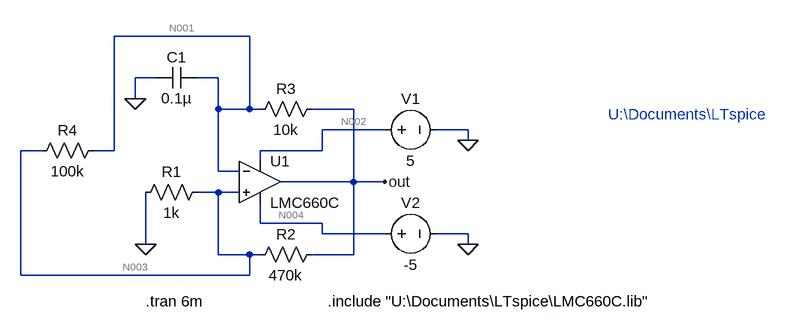
[diagram p0: schematic Square_Wave_Generator.asc]
Square_Wave_Generator.asc, the LTspice schematic file:
Version 4.1
SHEET 1 1384 680
WIRE 256 -112 48 -112
WIRE 112 -48 80 -48
WIRE 208 -48 176 -48
WIRE 80 -16 80 -48
WIRE 208 0 208 -48
WIRE 256 0 256 -112
WIRE 256 0 208 0
WIRE 272 0 256 0
WIRE 416 0 352 0
WIRE 464 32 368 32
WIRE 592 32 544 32
WIRE 592 48 592 32
WIRE -64 64 -96 64
WIRE 48 64 48 -112
WIRE 48 64 16 64
WIRE 368 64 368 32
WIRE 368 64 272 64
WIRE 272 80 272 64
WIRE 208 96 208 0
WIRE 240 96 208 96
WIRE 416 112 416 0
WIRE 416 112 304 112
WIRE 464 112 416 112
WIRE 208 128 176 128
WIRE 240 128 208 128
WIRE 272 176 272 144
WIRE 368 176 272 176
WIRE 368 192 368 176
WIRE 464 192 368 192
WIRE 592 192 544 192
WIRE 96 208 96 128
WIRE 592 208 592 192
WIRE 208 224 208 128
WIRE 256 224 208 224
WIRE 272 224 256 224
WIRE 416 224 416 112
WIRE 416 224 352 224
WIRE -96 256 -96 64
WIRE 256 256 256 224
WIRE 256 256 -96 256
FLAG 96 208 0
FLAG 80 -16 0
FLAG 464 112 out
FLAG 592 48 0
FLAG 592 208 0
SYMBOL res 192 112 R90
WINDOW 0 0 56 VBottom 2
WINDOW 3 32 56 VTop 2
SYMATTR InstName R1
SYMATTR Value 1k
SYMBOL res 368 208 R90
WINDOW 0 0 56 VBottom 2
WINDOW 3 32 56 VTop 2
SYMATTR InstName R2
SYMATTR Value 470k
SYMBOL res 368 -16 R90
WINDOW 0 0 56 VBottom 2
WINDOW 3 32 56 VTop 2
SYMATTR InstName R3
SYMATTR Value 10k
SYMBOL cap 176 -64 R90
WINDOW 0 0 32 VBottom 2
WINDOW 3 32 32 VTop 2
SYMATTR InstName C1
SYMATTR Value 0.1µ
SYMBOL voltage 448 32 R270
WINDOW 0 32 56 VTop 2
WINDOW 3 -32 56 VBottom 2
WINDOW 123 0 0 Left 0
WINDOW 39 0 0 Left 0
SYMATTR InstName V1
SYMATTR Value 5
SYMBOL voltage 448 192 R270
WINDOW 0 32 56 VTop 2
WINDOW 3 -32 56 VBottom 2
WINDOW 123 0 0 Left 0
WINDOW 39 0 0 Left 0
SYMATTR InstName V2
SYMATTR Value -5
SYMBOL OpAmps\\opamp2 272 48 R0
SYMATTR InstName U1
SYMATTR Value LMC660C
SYMBOL res 32 48 R90
WINDOW 0 0 56 VBottom 2
WINDOW 3 32 56 VTop 2
SYMATTR InstName R4
SYMATTR Value 100k
TEXT 96 296 Left 2 !.tran 6m
TEXT 376 296 Left 2 !.include "U:\\Documents\\LTspice\\LMC660C.lib"
TEXT 808 8 Left 2 ;U:\\Documents\\LTspice

The netlist it stands for:
* Square_Wave_Generator.asc
R1 N003 0 1k
R2 out N003 470k
R3 out N001 10k
C1 N001 0 0.1µ
V1 N002 0 5
V2 N004 0 -5
X§U1 N003 N001 N002 N004 out LMC660C  ; pins In+ In- V+ V- OUT
R4 N001 N003 100k
.tran 6m
.include "U:\Documents\LTspice\LMC660C.lib"
* U:\Documents\LTspice
.backanno
.end

* Results of the author's LTspice run, read from the files saved beside the schematic
* Operating Point, zero values left out:
*   V(out) = 6.674 mV
*   V(n002) = 5 V
*   V(n004) = -5 V
*   V(n003) = 74.05 µV
*   V(n001) = 6.074 mV
*   I(R3) = 60 nA
*   I(V1) = -393.9 µA
*   I(R1) = 74.05 nA
*   I(V2) = 393.8 µA
*   I(R2) = 14.04 nA
*   I(R4) = 60 nA
*   Ix(u1:99) = 393.9 µA
*   Ix(u1:50) = -393.8 µA
*   Ix(u1:28) = -74.05 nA
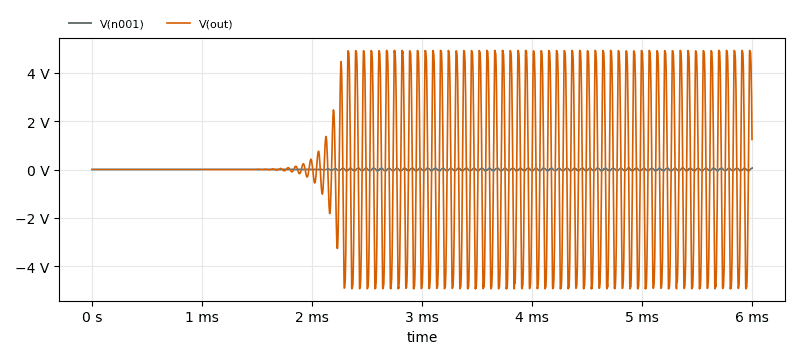
[diagram p1: Transient Analysis of Square_Wave_Generator.asc, plotted from the saved traces]
* Transient Analysis, 1 run:
*   V(n001): min -53.56 mV, max 65.89 mV, average 6.011 mV, rms 33.21 mV, last 63.77 mV
*   V(out): min -4.933 V, max 4.935 V, average 16.2 mV, rms 2.956 V, last 1.245 V